# EAGLE design cc1120em (EAGLE 6.5.0)
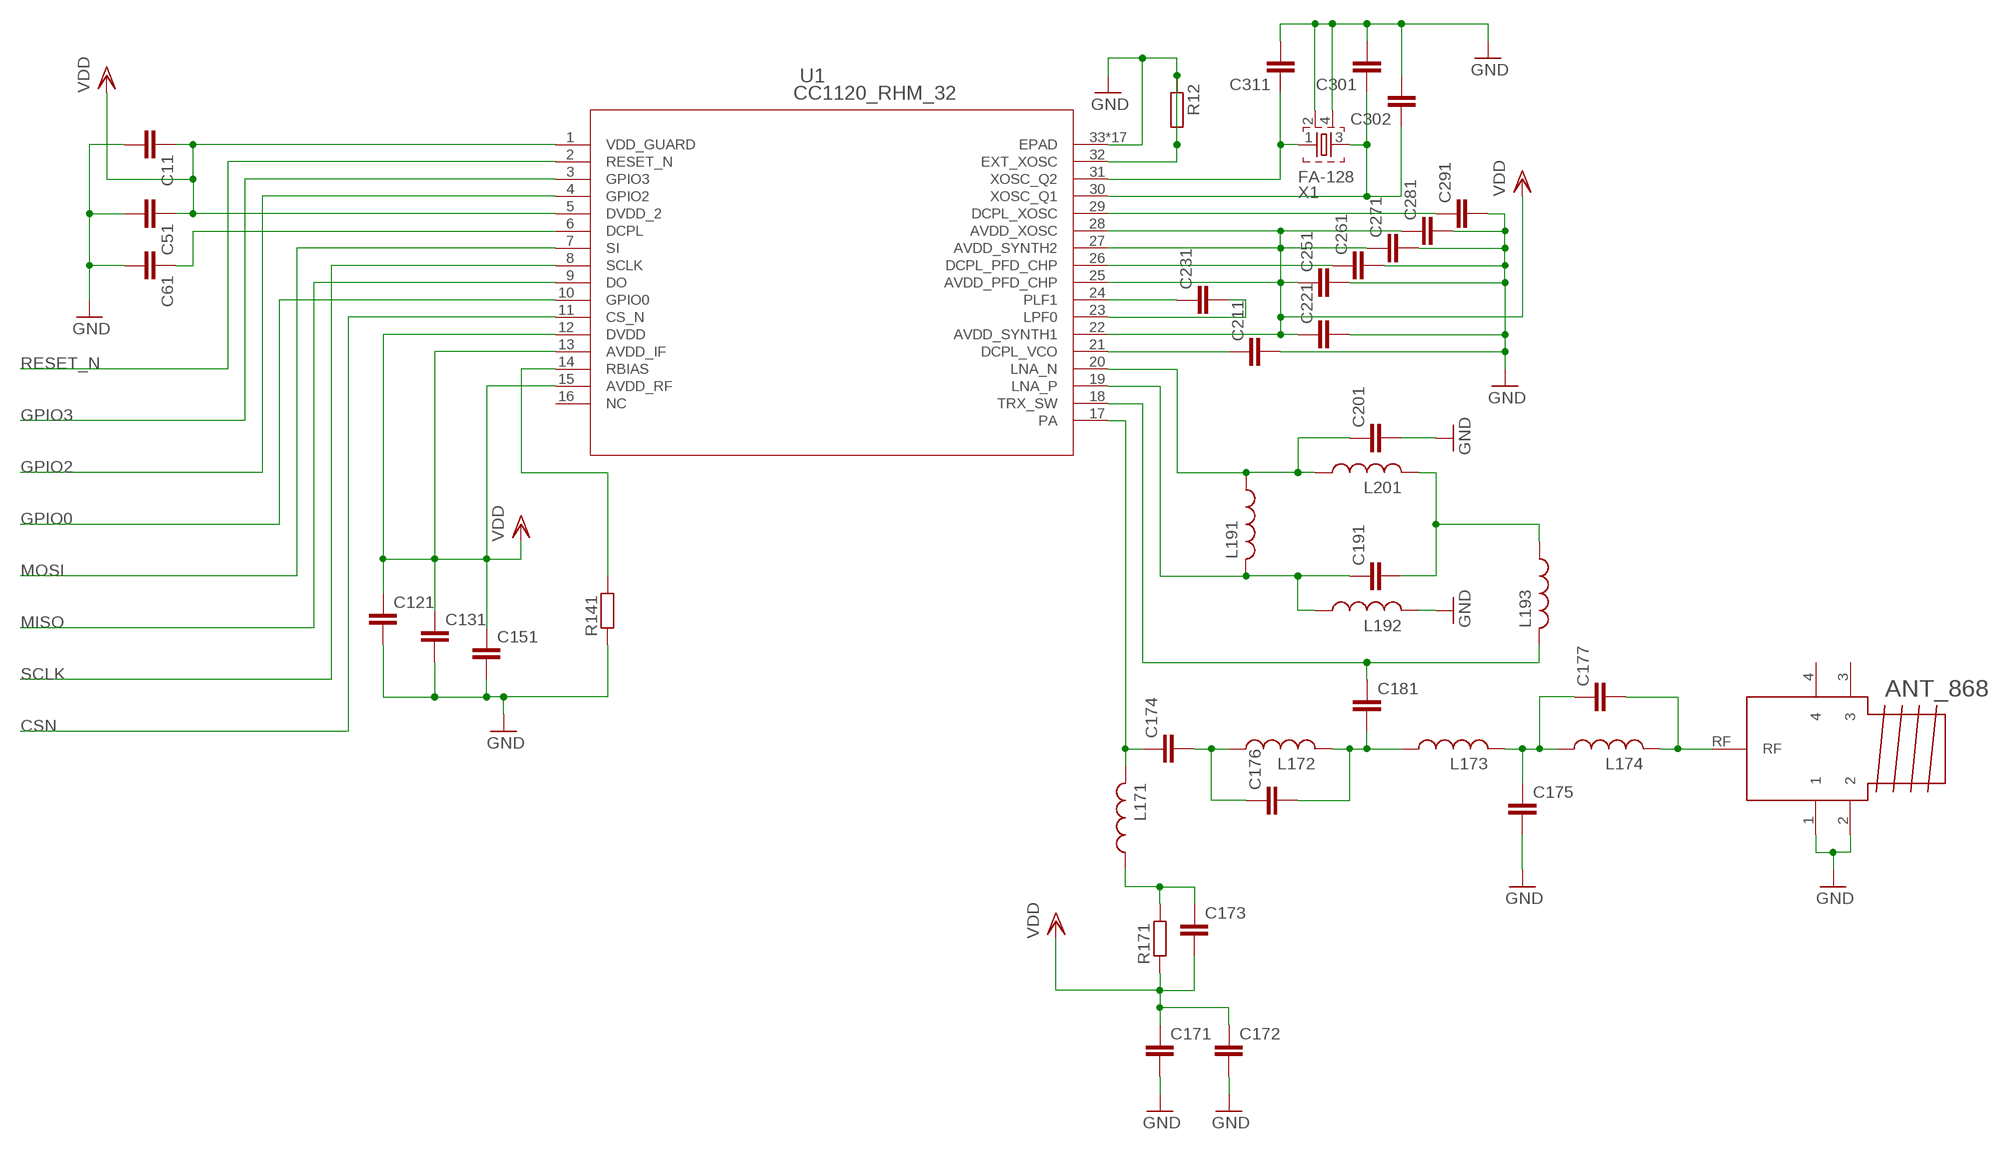
[diagram p0: schematic, sheet 1]

## Parts
ANT_868  SMA  [JOHNSON_142-0701-806]
C11  C_EU  [C0402_SMALL]
C51  C_EU  [C0402_SMALL]
C61  C_EU  [C0402_SMALL]
C121  C_EU  [C0402_SMALL]
C131  C_EU  [C0402_SMALL]
C151  C_EU  [C0402_SMALL]
C171  C_EU  [C0402_SMALL]
C172  C_EU  [C0402_SMALL]
C173  C_EU  [C0402_SMALL]
C174  C_EU  [C0402_SMALL]
C175  C_EU  [C0402_SMALL]
C176  C_EU  [C0402_SMALL]
C177  C_EU  [C0402_SMALL]
C181  C_EU  [C0402_SMALL]
C191  C_EU  [C0402_SMALL]
C201  C_EU  [C0402_SMALL]
C211  C_EU  [C0402_SMALL]
C221  C_EU  [C0402_SMALL]
C231  C_EU  [C0402_SMALL]
C251  C_EU  [C0402_SMALL]
C261  C_EU  [C0402_SMALL]
C271  C_EU  [C0402_SMALL]
C281  C_EU  [C0402_SMALL]
C291  C_EU  [C0402_SMALL]
C301  C_EU  [C0402_SMALL]
C302  C_EU  [C0402_SMALL]
C311  C_EU  [C0402_SMALL]
L171  L_US  [C0402_SMALL]
L172  L_US  [C0402_SMALL]
L173  L_US  [C0402_SMALL]
L174  L_US  [C0402_SMALL]
L191  L_US  [C0402_SMALL]
L192  L_US  [C0402_SMALL]
L193  L_US  [C0402_SMALL]
L201  L_US  [C0402_SMALL]
R12  R_EU  [C0402_SMALL]
R141  R_EU  [C0402_SMALL]
R171  R_EU  [C0402_SMALL]
U1  CC1120_RHM_32  [RHM32_3P7X3P7]
X1  FA-128  [FA-128]

## Nets
CSN: U1.11(CS_N)
GND: ANT_868.1 ANT_868.2 C11.2 C51.2 C61.2 C121.2 C131.2 C151.2 C171.2 C172.2 C175.2 C201.2 C211.2 C221.2 C251.2 C261.2 C271.2 C281.2 C291.2 C301.2 C302.2 C311.2 L192.2 R12.1 R12.2 R141.1 U1.32(EXT_XOSC) U1.33(EPAD) U1.V(EPAD) U1.V_2(EPAD) U1.V_3(EPAD) U1.V_4(EPAD) U1.V_5(EPAD) U1.V_6(EPAD) U1.V_7(EPAD) U1.V_8(EPAD) U1.V_9(EPAD) U1.V_10(EPAD) U1.V_11(EPAD) U1.V_12(EPAD) U1.V_13(EPAD) U1.V_14(EPAD) U1.V_15(EPAD) U1.V_16(EPAD) X1.2 X1.4
GPIO0: U1.10(GPIO0)
GPIO2: U1.4(GPIO2)
GPIO3: U1.3(GPIO3)
MISO: U1.9(DO)
MOSI: U1.7(SI)
N$1: C231.1 U1.24(PLF1)
N$2: C231.2 U1.23(LPF0)
N$3: C211.1 U1.21(DCPL_VCO)
N$4: C61.1 U1.6(DCPL)
N$5: C261.1 U1.26(DCPL_PFD_CHP)
N$6: C311.1 U1.31(XOSC_Q2) X1.1
N$7: C301.1 C302.1 U1.30(XOSC_Q1) X1.3
N$8: C291.1 U1.29(DCPL_XOSC)
N$9: C201.1 L191.1 L201.1 U1.20(LNA_N)
N$10: C191.1 L191.2 L192.1 U1.19(LNA_P)
N$11: C191.2 L193.1 L201.2
N$12: C181.1 L193.2 U1.18(TRX_SW)
N$13: R141.2 U1.14(RBIAS)
N$14: C174.1 L171.2 U1.17(PA)
N$15: C174.2 C176.1 L172.1
N$16: C176.2 C181.2 L172.2 L173.1
N$17: C175.1 C177.1 L173.2 L174.1
N$18: ANT_868.RF C177.2 L174.2
N$19: C173.1 L171.1 R171.2
RESET_N: U1.2(RESET_N)
SCLK: U1.8(SCLK)
VDD: C11.1 C51.1 C121.1 C131.1 C151.1 C171.1 C172.1 C173.2 C221.1 C251.1 C271.1 C281.1 R171.1 U1.1(VDD_GUARD) U1.5(DVDD_2) U1.12(DVDD) U1.13(AVDD_IF) U1.15(AVDD_RF) U1.22(AVDD_SYNTH1) U1.25(AVDD_PFD_CHP) U1.27(AVDD_SYNTH2) U1.28(AVDD_XOSC)
Unconnected: U1.16(NC)

## Power pins joined to a net without a drawn wire
3: ANT_868.3
4: ANT_868.4

## Library data of the parts
ANT_868 = CC11x:SMA
C11 C51 C61 C121 C131 C151 C171-C177 C181 C191 C201 C211 C221 C231 C251 C261 C271 C281 C291 C301 C302 C311 = CC11x:C_EU
L171-L174 L191-L193 L201 = CC11x:L_US
R12 R141 R171 = CC11x:R_EU
U1 = CC11x:CC1120_RHM_32; DATASHEETURL: http://www.ti.com/lit/gpn/CC1120; DESCRIPTION: High Performance RF Transceiver for Narrowband Systems; FAMILY_NAME: SUB-1 GHZ; GENERIC_PART_NUMBER: CC1120; INDUSTRY_STD_PKG_TYPE: QFN; MANUFACTURER: Texas Instruments; PACKAGE_DESIGNATOR: RHM; PIN_COUNT: 32
X1 = crystal:FA-: MHz RANGE CRYSTAL UNIT Source: Epson Toyocom

## Board
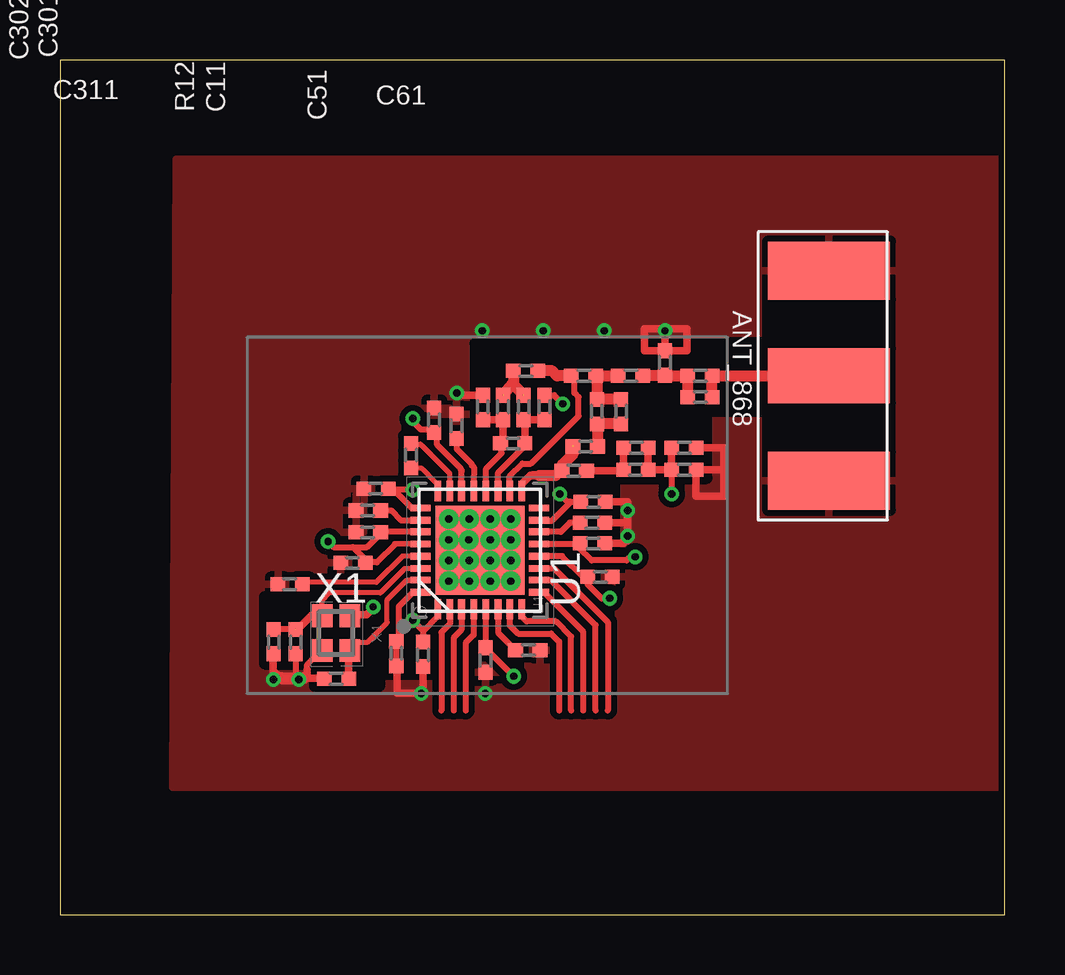
[diagram p1: board, top side]
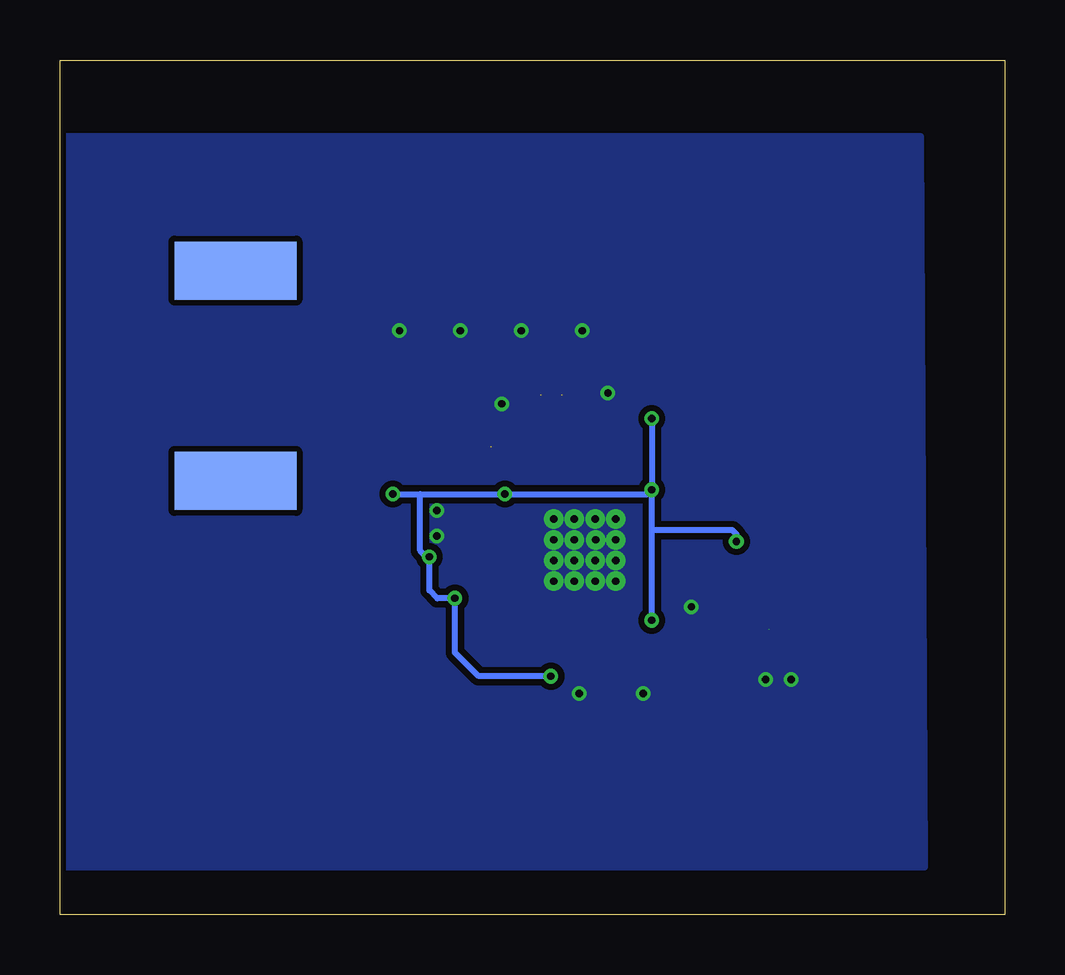
[diagram p2: board, bottom side, seen from below]

Size 39.38 x 35.61 mm. Coordinates in mm from the lower left corner, seen from the top.
Outline: 0,0 39.38,0 39.38,35.61 0,35.61 0,0
Copper layers (1*16): Top 0.035mm / dielectric 1.5mm / Bottom 0.035mm
Design rules "Hackvana": minimum track width 6mil, minimum drill 0.3mm, track to track 6mil, track to pad 6mil, pad to pad 6mil, via to via 6mil, smd to smd 0mil, copper to edge 6mil, drill to drill 6mil, minimum pad ring 10mil, minimum via ring 6mil, stop-mask expansion 2mil, vias tented up to drill 100mil, thermal gap 10mil
tRestrict: area 17.3,18.2 to 26.9,23.8; area 20.5,15.1 to 23.1,18.2; area 26.9,21 to 29.8,23.8; area 13.8,11.4 to 15.6,13.7; area 10.6,9.5 to 13.3,13.2; area 13.3,10 to 15.6,11.8; area 8.5,10.5 to 10.6,13.2

### Footprints (pad centres in the part's own frame; a part is rotated, then mirrored left to right if it is on the bottom)
JOHNSON_142-0701-806 = smd 2.413 x 5.08: 1 -4.381,-2.54; 2 4.381,-2.54 | smd 2.413 x 5.08 bottom: 3 4.381,-2.54; 4 -4.381,-2.54 | smd 2.286 x 5.08: RF 0,-2.54
C0402_SMALL = smd 0.61 x 0.584: 1 -0.536,0; 2 0.485,0
RHM32_3P7X3P7 = smd 0.838 x 0.279: 1 -2.464,1.753; 2 -2.464,1.245; 3 -2.464,0.762; 4 -2.464,0.254; 5 -2.464,-0.254; 6 -2.464,-0.762; 7 -2.464,-1.245; 8 -2.464,-1.753; 17 2.464,-1.753; 18 2.464,-1.245; 19 2.464,-0.762; 20 2.464,-0.254; 21 2.464,0.254; 22 2.464,0.762; 23 2.464,1.245; 24 2.464,1.753 | smd 0.279 x 0.838: 9 -1.753,-2.464; 10 -1.245,-2.464; 11 -0.762,-2.464; 12 -0.254,-2.464; 13 0.254,-2.464; 14 0.762,-2.464; 15 1.245,-2.464; 16 1.753,-2.464; 25 1.753,2.464; 26 1.245,2.464; 27 0.762,2.464; 28 0.254,2.464; 29 -0.254,2.464; 30 -0.762,2.464; 31 -1.245,2.464; 32 -1.753,2.464 | smd 3.708 x 3.708: 33 0,0 | drill 0.305: V 1.295,1.295; V_2 -1.295,-0.432; V_3 -1.295,-1.295; V_4 -1.295,0.432; V_5 -1.295,1.295; V_6 -0.432,-1.295; V_7 -0.432,-0.432; V_8 -0.432,0.432; V_9 -0.432,1.295; V_10 0.432,-1.295; V_11 0.432,-0.432; V_12 0.432,0.457; V_13 0.432,1.295; V_14 1.295,-1.295; V_15 1.295,-0.432; V_16 1.295,0.432
FA-128 = smd 0.95 x 0.85: 1 -0.725,-0.575; 2 0.725,-0.575; 3 0.725,0.575; 4 -0.725,0.575

### Placement (x,y rotation side)
ANT_868  34.59,22.45 270 top
C11  15.14,10.82 270 top
C51  17.74,10.59 270 top
C61  19.53,11.02 0 top
C121  22.53,14.07 0 top
C131  22.23,15.47 0 top
C151  22.25,17.2 0 top
C171  26.04,19.46 0 top
C172  26.04,18.54 0 top
C173  24.03,19.46 0 top
C174  21.92,19.51 0 top
C175  25.22,23.01 90 top
C176  23.39,20.98 90 top
C177  26.7,21.56 0 top
C181  21.84,22.45 0 top
C191  19.33,21.16 90 top
C201  17.63,21.16 90 top
C211  16.54,20.37 90 top
C221  15.6,20.62 90 top
C231  14.63,19.15 90 top
C251  13.16,17.75 180 top
C261  12.83,16.84 180 top
C271  12.83,15.93 180 top
C281  12.19,14.66 180 top
C291  9.58,13.77 180 top
C301  9.83,11.35 270 top
C302  8.92,11.35 270 top
C311  11.51,9.83 180 top
L171  21.41,18.49 180 top
L172  22.38,20.98 90 top
L173  23.8,22.45 0 top
L174  26.7,22.45 0 top
L191  18.9,19.63 0 top
L192  20.19,21.16 90 top
L193  19.43,22.66 0 top
L201  18.47,21.16 90 top
R12  14.02,10.9 90 top
R141  22.17,16.33 180 top
R171  23.98,18.54 180 top
U1  17.5,15.19 90 top
X1  11.51,11.73 90 top

### Tracks (layer width: path | path; a pad name or v marks a point on that pad's centre or on a via)
CSN
  Top 0.254: U1.11 20.6,14.43 22.84,12.19 22.84,8.51
GND  (via drill 0.3)
  Top 0.254: 10.31,10.21 10.31,10.42 10.82,10.92 | 10.82,10.92 10.93,11.04 | X1.4 10.82,11.01 10.82,10.92 | X1.2 12.17,12.46 12.17,12.49 | 11.02,9.86 C311.2 | C301.2 9.83,9.86 | C302.2 8.91,10.69 8.89,10.67 | 14.07,11.41 14.12,11.41 14.12,12.83 14.73,13.45 U1.32 | 14.02,11.36 13.96,11.3 14.02,11.3 R12.1 | 14.02,11.36 14.07,11.41 | 14.02,11.41 14.07,11.41 | R12.2 14.02,11.36 | L192.2 20.6,21.64 v20.95,21.29
  Top 0.304: 12.08,12.49 12.17,12.49 12.79,12.49 13.08,12.78 | 8.89,10.9 8.89,10.67 8.89,10.16 9.2,9.86 9.22,9.86 | 10.31,9.86 11.02,9.86 | 10.31,9.86 10.31,10.21 | 10.16,9.86 10.31,9.86
  Top 0.305: C172.2 26.52,17.42 27.69,17.42 27.69,18.54 | 27.69,18.54 26.49,18.54 | C171.2 27.69,19.46 27.69,18.54 | C201.2 16.64,21.64 v16.54,21.74 | 24.36,23.5 24.36,24.41 26.14,24.41 26.14,23.5 24.36,23.5 | C175.2 v25.22,24.33 | C151.2 23.65,17.2 23.65,16.33 | 23.65,16.33 R141.1 | C131.2 23.5,15.47 23.5,15.57 23.65,15.57 23.65,16.33 | 15.14,9.3 v15.06,9.22 | R12.1 14.05,10.34 14.05,9.22 v15.06,9.22 | C11.2 15.14,9.22 v15.06,9.22 | 13.08,12.78 13.08,12.83 v13.06,12.83
  Top 0.508: 9.22,9.86 9.83,9.86 10.16,9.86
  other vias: 22.68,24.33 20.14,24.33 17.6,24.33 17.73,9.22 23.67,16.84 23.67,15.77 9.96,9.8 8.89,9.8
  pour Top (isolate 0.254, rank 2): 39.73,31.47 39.73,5.31 4.7,5.31 4.85,31.47
  pour Bottom (isolate 0.254, rank 2): 44.63,32.41 44.63,2.01 3.35,2.01 3.51,32.41
GPIO0
  Top 0.254: 22.33,8.51 22.33,12.06 20.45,13.95 U1.10
GPIO2
  Top 0.254: U1.4 17.25,11.66 16.92,11.33 16.92,8.51
GPIO3
  Top 0.254: U1.3 16.74,11.86 16.41,11.53 16.41,8.51
MISO
  Top 0.254: 20.27,13.44 U1.9 20.17,13.44 21.82,11.79 21.82,8.51
MOSI
  Top 0.254: U1.7 18.75,12.06 19.1,11.71 20.47,11.71 20.8,11.38 20.8,8.51
N$1
  Top 0.203: 15.74,17.94 15.09,18.59 14.63,18.59
  Top 0.254: 15.74,17.94 15.75,17.93 U1.24 | 14.63,18.59 C231.1
N$2
  Top 0.203: 14.63,19.61 14.76,19.61 15.02,19.61 16.24,18.39 16.24,18.14 16.25,17.94
  Top 0.254: 16.25,17.94 16.26,17.93 U1.23 | C231.2 14.66,19.61 14.76,19.61
N$3
  Top 0.254: U1.21 17.25,17.99 17.25,18.64 17.17,18.72 17.17,18.77 16.54,19.41 C211.1 16.54,19.86
N$4
  Top 0.254: U1.6 18.26,11.75 C61.1
N$5
  Top 0.254: C261.1 13.82,16.84 14.22,16.43 U1.26
N$6
  Top 0.203: 12.08,11.04 12.08,11.35 12.83,11.35 13.64,12.17 13.64,13.13 14.44,13.93 14.48,13.93
  Top 0.254: 14.48,13.93 14.73,13.95 U1.31 | X1.1 12.04,11.01 12.04,10.95 | C311.1 12.04,9.86
  Top 0.304: 12.08,11.04 12.04,11.04 12.04,10.95 12.04,9.86
N$7  (1 unrouted)
  Top 0.203: 14.76,14.42 14.73,14.42 14.36,14.42 13.36,13.41 11.23,13.41 10.9,13.08 10.9,12.47
  Top 0.254: 14.76,14.42 U1.30 | X1.3 10.95,12.46 10.95,12.47 | C301.1 C302.1 | 9.91,11.89 C301.1
  Top 0.304: 9.91,11.89 10.49,12.47 10.9,12.47 10.95,12.47 10.96,12.46
N$8
  Top 0.203: 10.19,13.84 13.18,13.84 14.28,14.94 14.71,14.94 14.76,14.95 U1.29
  Top 0.254: 10.19,13.84 10.13,13.79 10.11,13.79 C291.1 | U1.29
N$9
  Top 0.254: U1.20 17.76,17.66 17.76,17.94 17.76,18.58 18.41,19.23 18.41,19.61 18.38,19.63 L191.1
  Top 0.305: C201.1 L201.1 18.47,19.74 L191.1
N$10
  Top 0.254: U1.19 18.26,17.94 18.26,18.42 19.3,19.46 19.3,19.55 L191.2
  Top 0.305: L192.1 C191.1 19.38,20.62 L191.2
N$11  (2 unrouted)
  Top 0.254: L193.1 18.9,22.61
  Top 0.457: 18.9,22.68 18.9,22.61 18.9,22.14 18.87,22.11 | 18.87,22.11 19.33,21.66 | 18.87,22.11 18.47,21.66
N$12
  Top 0.254: U1.18 18.75,18.26 19.28,18.8 19.63,18.8 21.61,20.78 21.61,21.57 21.44,21.74 21.44,22.25 21.26,22.43 | 21.29,22.45 C181.1 | L193.2 19.94,22.66
  Top 0.305: 21.26,22.43 21.28,22.43 C181.1
  Top 0.457: 21.29,22.45 20.73,22.45 20.52,22.66 19.94,22.66
N$13
  Top 0.254: R141.2 21.26,16.33 20.88,15.95 U1.14
N$14  (1 unrouted)
  Top 0.254: 19.27,17.96 19.25,17.95 U1.17 | L171.2 20.88,18.44 20.8,18.44
  Top 0.304: 19.27,17.96 19.61,18.3 19.7,18.3
  Top 0.355: 19.7,18.3 19.98,18.3
  Top 0.457: 19.98,18.3 20.66,18.3 20.8,18.44 20.84,18.48 20.94,18.48 20.94,18.75 21.4,19.21 21.4,19.49
N$15
  Top 0.457: C176.1 L172.1 22.41,20.42 C174.2
N$16
  Top 0.457: L173.1 C181.2 22.38,22.41 L172.2 C176.2
N$17
  Top 0.457: L173.2 24.31,22.48 C175.1 25.25,22.45 L174.1 C177.1
N$18
  Top 0.457: C177.2 L174.2 ANT_868.RF
N$19
  Top 0.305: L171.1 23.49,18.49 R171.2 C173.1
RESET_N
  Top 0.254: U1.2 16.26,12.12 15.9,11.76 15.9,8.51
SCLK
  Top 0.254: U1.8 19.25,12.42 19.46,12.22 20.68,12.22 21.31,11.58 21.31,8.51
VDD  (via drill 0.3)
  Top 0.254: U1.22 16.74,17.98 16.75,17.99 16.74,18.46 16.74,18.5 16.71,18.53 16.71,18.58 15.72,19.57 15.72,20.12 15.7,20.09 C221.1 15.47,20.22 15.04,20.22 14.71,20.55 v14.71,20.68 | 21.3,17.2 20.52,16.42 20.27,16.42 20.27,16.43 U1.15 | 21.3,17.2 21.16,17.2 v20.83,17.53 | C151.1 21.69,17.2 | C151.1 21.77,17.2 | 21.3,17.2 C151.1 | U1.13 21.66,15.44 C131.1 21.64,15.47 21.64,15.29 22.17,14.76 23.62,14.76 23.77,14.91 v23.98,14.91 | U1.12 20.93,14.94 21.79,14.07 C121.1 22,13.77 22.58,13.18 v22.91,13.18 | U1.25 14.68,16.94 13.87,17.75 C251.1 13.74,17.7 v14.71,17.7 | U1.27 13.36,15.95 C271.1 13.36,15.88 12.8,15.32 12.22,15.32 | 12.22,15.32 12.72,14.81 12.72,14.68 | 12.22,15.32 11.4,15.32 v11.18,15.54 | 12.72,14.68 13.21,14.68 13.97,15.44 14.73,15.45 U1.28 | C281.1 12.72,14.68 | 15.14,11.82 15.14,11.84 v14.71,12.27 | 15.14,11.82 15.74,12.43 15.75,12.43 U1.1 | 15.14,11.82 C11.1 | U1.5 17.75,11.12 C51.1 17.74,11.11 v18.91,9.93 | C172.1 v25.5,17.53
  Top 0.305: C173.2 R171.1 C172.1 C171.1
  Bottom 0.254: v14.71,12.27 14.71,16.03 | 14.71,16.03 v14.71,17.7 | v11.18,15.54 11.18,15.85 11.35,16.03 14.71,16.03 | v14.71,20.68 v14.71,17.7 | v14.71,17.7 14.88,17.53 v20.83,17.53 24.36,17.53 | v25.5,17.53 24.36,17.53 | 24.36,17.53 24.36,15.16 24.11,14.91 v23.98,14.91 23.98,13.51 23.65,13.18 v22.91,13.18 22.91,10.92 21.92,9.93 v18.91,9.93